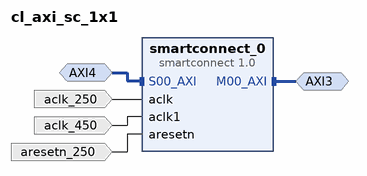
[diagram p0: block diagram of the top level]
# Vivado block design cl_axi_sc_1x1, xcvu47p-fsvh2892-2-e, Vivado 2024.1
create_bd_design cl_axi_sc_1x1

create_bd_intf_port -mode Master -vlnv xilinx.com:interface:aximm_rtl:1.0 AXI3
set_property -dict [list \
  CONFIG.ADDR_WIDTH 64 \
  CONFIG.DATA_WIDTH 256 \
  CONFIG.FREQ_HZ 450000000 \
  CONFIG.HAS_BURST 0 \
  CONFIG.HAS_LOCK 0 \
  CONFIG.HAS_PROT 0 \
  CONFIG.HAS_QOS 0 \
  CONFIG.NUM_READ_OUTSTANDING 64 \
  CONFIG.NUM_WRITE_OUTSTANDING 64 \
  CONFIG.PROTOCOL AXI3 \
] [get_bd_intf_ports AXI3]
create_bd_intf_port -mode Slave -vlnv xilinx.com:interface:aximm_rtl:1.0 AXI4
set_property -dict [list \
  CONFIG.ADDR_WIDTH 64 \
  CONFIG.ARUSER_WIDTH 0 \
  CONFIG.AWUSER_WIDTH 0 \
  CONFIG.BUSER_WIDTH 0 \
  CONFIG.DATA_WIDTH 512 \
  CONFIG.FREQ_HZ 250000000 \
  CONFIG.HAS_BRESP 1 \
  CONFIG.HAS_BURST 0 \
  CONFIG.HAS_CACHE 1 \
  CONFIG.HAS_LOCK 0 \
  CONFIG.HAS_PROT 0 \
  CONFIG.HAS_QOS 0 \
  CONFIG.HAS_REGION 0 \
  CONFIG.HAS_RRESP 1 \
  CONFIG.HAS_WSTRB 1 \
  CONFIG.ID_WIDTH 16 \
  CONFIG.MAX_BURST_LENGTH 64 \
  CONFIG.NUM_READ_OUTSTANDING 32 \
  CONFIG.NUM_READ_THREADS 1 \
  CONFIG.NUM_WRITE_OUTSTANDING 32 \
  CONFIG.NUM_WRITE_THREADS 1 \
  CONFIG.PROTOCOL AXI4 \
  CONFIG.READ_WRITE_MODE READ_WRITE \
  CONFIG.RUSER_BITS_PER_BYTE 0 \
  CONFIG.RUSER_WIDTH 0 \
  CONFIG.SUPPORTS_NARROW_BURST 0 \
  CONFIG.WUSER_BITS_PER_BYTE 0 \
  CONFIG.WUSER_WIDTH 0 \
  CONFIG.master_id 1 \
] [get_bd_intf_ports AXI4]
create_bd_port -dir I -type clk aclk_250
set_property -dict [list \
  CONFIG.ASSOCIATED_BUSIF AXI4 \
  CONFIG.ASSOCIATED_RESET aresetn_250 \
  CONFIG.FREQ_HZ 250000000 \
] [get_bd_ports aclk_250]
create_bd_port -dir I -type clk aclk_450
set_property -dict {CONFIG.ASSOCIATED_BUSIF AXI3 CONFIG.FREQ_HZ 450000000} [get_bd_ports aclk_450]
create_bd_port -dir I -type rst aresetn_250

create_bd_cell -type ip -vlnv xilinx.com:ip:smartconnect:1.0 smartconnect_0
set_property -dict {CONFIG.NUM_CLKS 2 CONFIG.NUM_MI 1 CONFIG.NUM_SI 1} [get_bd_cells smartconnect_0]

# ---- connections ----

connect_bd_intf_net -intf_net AXI4_1 [get_bd_intf_ports AXI4] [get_bd_intf_pins smartconnect_0/S00_AXI]
connect_bd_intf_net [get_bd_intf_ports AXI3] [get_bd_intf_pins smartconnect_0/M00_AXI]
connect_bd_net -net aclk_250_1 [get_bd_ports aclk_250] [get_bd_pins smartconnect_0/aclk]
connect_bd_net -net aclk_450_1 [get_bd_ports aclk_450] [get_bd_pins smartconnect_0/aclk1]
connect_bd_net -net aresetn_0_1 [get_bd_ports aresetn_250] [get_bd_pins smartconnect_0/aresetn]

# ---- address map ----
assign_bd_address -offset 0x0000000000000000 -range 16E -target_address_space [get_bd_addr_spaces AXI4] [get_bd_addr_segs AXI3/Reg]

validate_bd_design
save_bd_design
